# Altium project 0020-03_FFT2G.PrjPcb (part 4 of 5)

## Sheet [19] Switching Regulator Module.SchDoc: Switching regulator module
size 299 x 210 mm; Address1: Gruvgatan 8; Address2: SE-42130 Västra Frölunda; Address3: http://www.omnisys.se; Address4: Phone: +46 31 734 3400; Revision: Rev; SheetNumber: 19; SheetTotal: 21; CompanyName: Omnisys Instruments AB; Project: Enter value; ReleaseDate: Date; PageSetup: Record=PageOptions|CenterHorizontal=True|CenterVertical=True|PrintScale=0.97|XCorrection=1.00|YCorrection=1.00|PrintKind=0|BorderSize=5000000|LeftOffset=0|BottomOffset=0|Orientation=2|PaperLength=1000|PaperWidth=1000|Scale=100|PaperSource=7|PrintQuality=-4|MediaType=1|DitherType=10|PaperKind=A3|PrintScaleMode=1; Notes: No notes; Part_And_Rev: 0000-00; Drawing_Configuration: No Configuration; Adr1: August Barks gata 6B; Adr2: SE-421 32 Västra Frölunda; Adr3: Sweden; Webpage: www.omnisys.se
Used 4 times, as channels POWER/Ch_A 1.0V, POWER/Ch_B 2.5V, POWER/Ch_C 2.3V, POWER/Ch_D 3.8V. Parts and nets are listed once, with the designators drawn on the sheet.
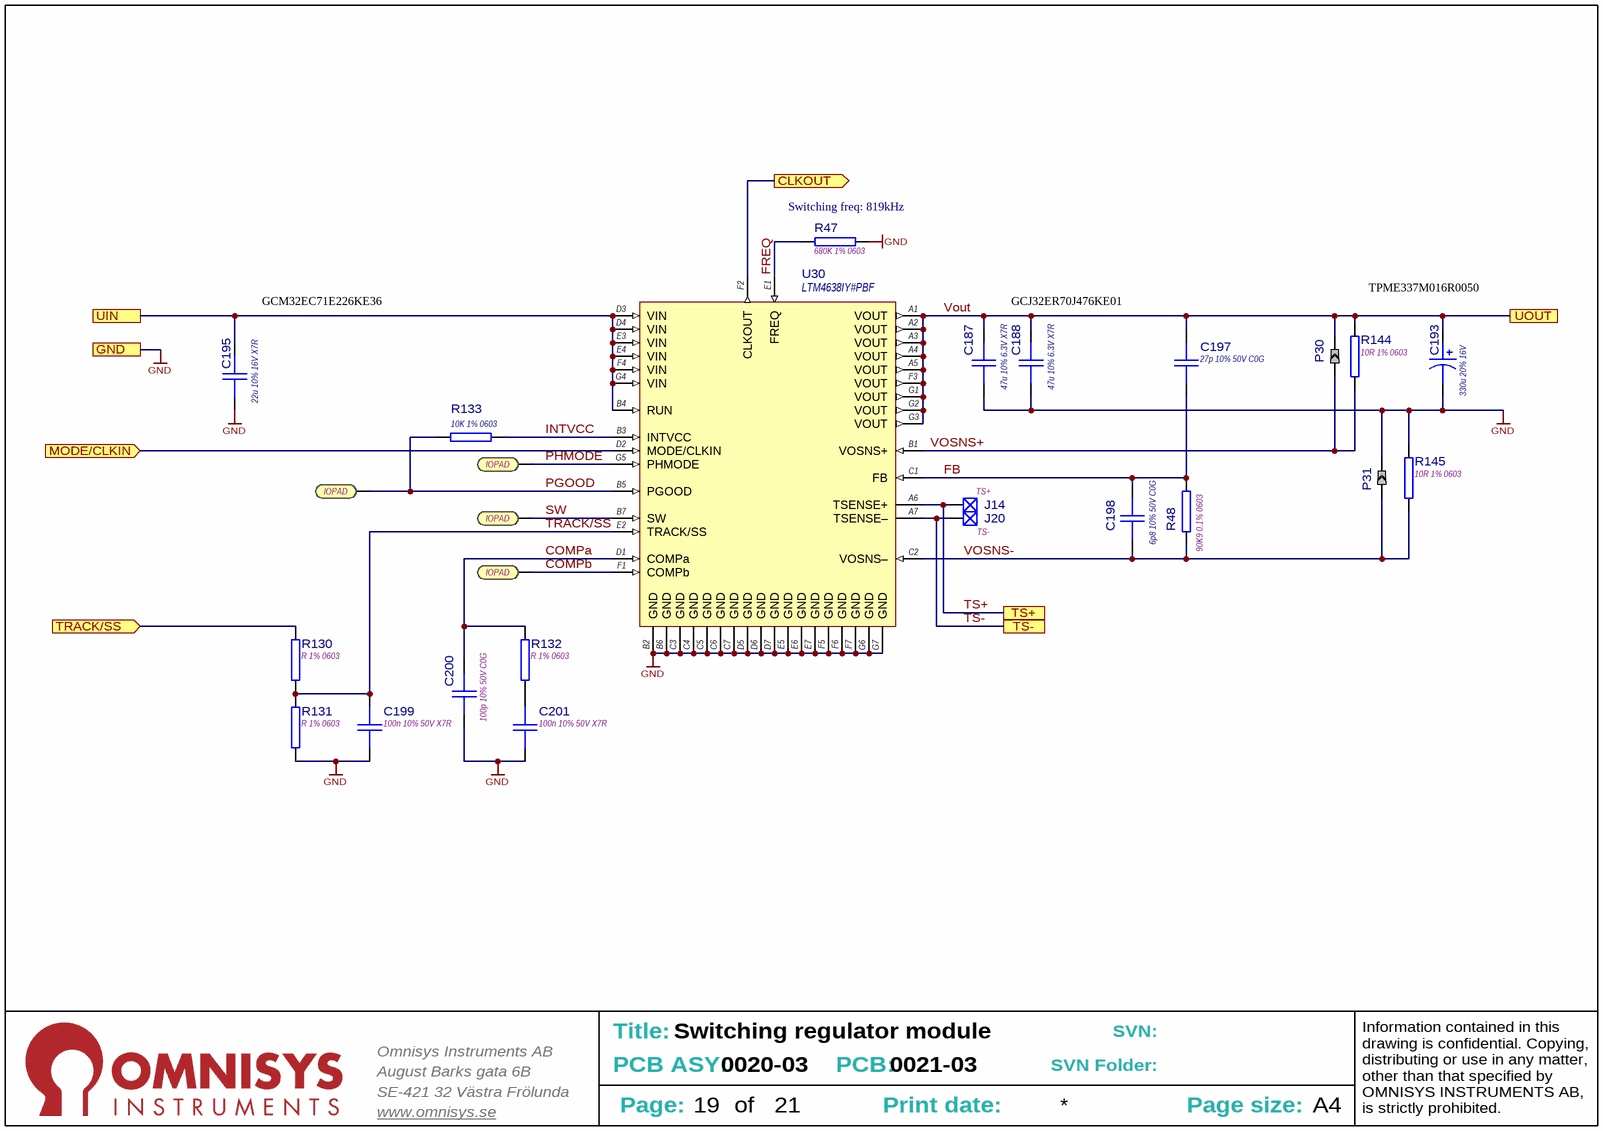
[diagram p11: [19] Switching Regulator Module.SchDoc]

### Parts
C187  47u 10% 6.3V X7R  [CAPC3225X270N]
C188  47u 10% 6.3V X7R  [CAPC3225X270N]
C193  330u 20% 16V  [CAPMP7343X43N]
C195  22u 10% 16V X7R  [CAPC3225X270N]
C197  27p 10% 50V C0G  [CAPC1608X90N]
C198  6p8 10% 50V C0G  [CAPC1608X90N]
C199  100n 10% 50V X7R  [CAPC1608X90N]
C200  100p 10% 50V C0G  [CAPC1608X90N]
C201  100n 10% 50V X7R  [CAPC1608X90N]
J12  IOPAD  [SMT_IO_PAD_2x1MM]  (no BOM)
J13  IOPAD  [SMT_IO_PAD_2x1MM]  (no BOM)
J14  TS+  [TP-SMD_1MM]
J16  IOPAD  [SMT_IO_PAD_2x1MM]  (no BOM)
J20  TS-  [TP-SMD_1MM]
J21  IOPAD  [SMT_IO_PAD_2x1MM]  (no BOM)
P30  Solder Jumper  [SolderJumper-Footprint-1]  (value not drawn)  (no BOM)
P31  Solder Jumper  [SolderJumper-Footprint-1]  (value not drawn)  (no BOM)
R47  680K 1% 0603  [RESC1608N]
R48  90K9 0.1% 0603  [RESC1608L]
R130  R 1% 0603  [RESC1608N]
R131  R 1% 0603  [RESC1608N]
R132  R 1% 0603  [RESC1608N]
R133  10K 1% 0603  [RESC1608L]
R144  10R 1% 0603  [RESC1608N]
R145  10R 1% 0603  [RESC1608N]
U30  LTM4638IY#PBF  [BGA49C80P7X7_625X625X536]

### Ports
CLKOUT (out), GND, MODE/CLKIN (in), TRACK/SS (in), TS+, TS-, UIN, UOUT

### Nets
GND: C187.2 C188.2 C193.2 C195.2 C199.2 C200.2 C201.2 P31.2 R47.1 R131.1 R145.2 U30.B2(GND) U30.B6(GND) U30.C3(GND) U30.C4(GND) U30.C5(GND) U30.C6(GND) U30.C7(GND) U30.D5(GND) U30.D6(GND) U30.D7(GND) U30.E5(GND) U30.E6(GND) U30.E7(GND) U30.F5(GND) U30.F6(GND) U30.F7(GND) U30.G6(GND) U30.G7(GND) ; port GND
CLKOUT: U30.F2(CLKOUT) ; port CLKOUT
COMPa: C200.1 R132.2 U30.D1(COMPa)
COMPb: J21.1 U30.F1(COMPb)
FB: C197.2 C198.1 R48.2 U30.C1(FB)
FREQ: R47.2 U30.E1(FREQ)
INTVCC: R133.2 U30.B3(INTVCC)
MODE/CLKIN: U30.D2(MODE/CLKIN) ; port MODE/CLKIN
PGOOD: J12.1 R133.1 U30.B5(PGOOD)
PHMODE: J13.1 U30.G5(PHMODE)
SW: J16.1 U30.B7(SW)
TRACK/SS: C199.1 R130.1 R131.2 U30.E2(TRACK/SS)
TRACK/SS: R130.2 ; port TRACK/SS  [a separate net that carries the same name]
TS+: J14.1 U30.A6(TSENSE+) ; port TS+
TS-: J20.1 U30.A7(TSENSE–) ; port TS-
UIN: C195.1 U30.B4(RUN) U30.D3(VIN) U30.D4(VIN) U30.E3(VIN) U30.E4(VIN) U30.F4(VIN) U30.G4(VIN) ; port UIN
VOSNS+: P30.1 R144.1 U30.B1(VOSNS+)
VOSNS-: C198.2 P31.1 R48.1 R145.1 U30.C2(VOSNS–)
Vout: C187.1 C188.1 C193.1 C197.1 P30.2 R144.2 U30.A1(VOUT) U30.A2(VOUT) U30.A3(VOUT) U30.A4(VOUT) U30.A5(VOUT) U30.F3(VOUT) U30.G1(VOUT) U30.G2(VOUT) U30.G3(VOUT) ; port UOUT
NetC201_1: C201.1 R132.1

### Channels
POWER/Ch_A 1.0V: designators end in .1; ports CLKOUT=CLK1 GND=GND MODE/CLKIN=NetP25_2 TRACK/SS=NetR130.1_2 TS+=TEMP_PWR TS-=GND UIN=UIN_F UOUT=+1V0
POWER/Ch_B 2.5V: designators end in .2; ports CLKOUT=CLK2 GND=GND MODE/CLKIN=NetP22_2 TRACK/SS=+1V0 TS+=TS+_Ch_B 2.5V TS-=TS-_Ch_B 2.5V UIN=UIN_F UOUT=+2V5
POWER/Ch_C 2.3V: designators end in .3; ports CLKOUT=CLK3 GND=GND MODE/CLKIN=NetP23_2 TRACK/SS=+2V5 TS+=TS+_Ch_C 2.3V TS-=TS-_Ch_C 2.3V UIN=UIN_F UOUT=+2V3
POWER/Ch_D 3.8V: designators end in .4; ports CLKOUT=NetU30.4_F2 GND=GND MODE/CLKIN=NetP24_2 TRACK/SS=+2V3 TS+=TS+_Ch_D 3.8V TS-=TS-_Ch_D 3.8V UIN=UIN_F UOUT=+3.8V

### Notes on the sheet
- (near R47) Switching freq: 819kHz
- GCM32EC71E226KE36
- GCJ32ER70J476KE01
- TPME337M016R0050
- August Barks gata 6B
- Omnisys Instruments AB
- Title:
- PCB ASY:
- PCB:
- SVN:
- SVN Folder:
- SE-421 32 Västra Frölunda
- www.omnisys.se
- Page:
- of
- Print date:
- Page size:
- A4
- Information contained in this drawing is confidential. Copying, distributing or use in any matter, other than that specified by OMNISYS INSTRUMENTS AB, is strictly prohibited.

### Library data of the parts
C187 C188 = CMP-0300-002062-5: Ceramic Chip Capacitor, 1210/3225; Capacitance: 47µF; Temperature Charateristics: X7R; Tolerance: 10%; Thickness: 2.7mm; Case/Package: 1210/3225; Rated Voltage: 6.3V
C193 = CMP-0300-000208-8: as C53 on sheet [16] POWER; Rated Voltage: 16V; Tolerance: 20%; Case/Package: 7343
C195 = CMP-0300-003327-5: Ceramic Chip Capacitor, 1210/3225; Capacitance: 22µF; Tolerance: 10%; Temperature Charateristics: X7R; Thickness: 2.7mm; Case/Package: 1210/3225; Rated Voltage: 16V
C197 = CMP-0300-002442-6: Ceramic Chip Capacitor, 0603/1608; Tolerance: 5%; Capacitance: 27pF; Package: 1608/0603; Temperature Charateristics: C0G; Rated Voltage: 50V; Thickness: 900µm; Weight: 9mg
C198 = CMP-0300-002430-5: Ceramic Chip Capacitor, 0603/1608; Tolerance: 0%; Capacitance: 6.8pF; Package: 1608/0603; Temperature Charateristics: C0G; Rated Voltage: 50V; Thickness: 900µm; Weight: 9mg
C199 C201 = CMP-0300-002665-6: as C161-C168 on sheet [11] FPGA_CONFIG; Package: 1608/0603; Temperature Charateristics: X7R; Tolerance: 10%; Rated Voltage: 50V; Thickness: 900µm; Weight: 9mg
C200 = CMP-0300-002450-6: Ceramic Chip Capacitor, 0603/1608; Tolerance: 5%; Capacitance: 100pF; Package: 1608/0603; Temperature Charateristics: C0G; Rated Voltage: 50V; Thickness: 900µm; Weight: 9mg
J12 J13 J16 J21 = CMP-1000-000152-5: IO pad used for test points and flying leads.
J14 J20 = CMP-3600-000000-1: TP SMD 1mm
P30 P31 = CMP-1600-000025-5: Solder jumper, clearance 0.125mm
R47 = CMP-1800-002089-5: Thick film Chip Resistor, 0603/1608; Power: 100mW; Maximum working voltage: 75V; Temp. Coefficent: 0.01%; Tolerance: 1%; Value: 680k; Case/Package: 0603/1608; Composition: Thick film
R48 = CMP-1800-002529-4: Thin film Chip Resistor, 0603/1608; Value: 90.9k; Maximum working voltage: 50V; Power: 100mW; Temp. Coefficent: 0.0015%; Tolerance: 0.1%; Case/Package: 0603/1608; Composition: Thin film
R130-R132 = CMP-1800-003157-4: Thick film Chip Resistor, 0603/1608; Power: 100mW; Maximum working voltage: 75V; Temp. Coefficent: 0.01%; Value: 1G; Tolerance: 1%; Case/Package: 0603/1608; Composition: Thick film
R133 = CMP-1800-002045-5: as R65#1 on sheet [16] POWER; Value: 10k; Tolerance: 1%; Case/Package: 0603/1608; Composition: Thick film
R144 R145 = CMP-1800-001974-5: Thick film Chip Resistor, 0603/1608; Value: 10; Power: 100mW; Maximum working voltage: 75V; Temp. Coefficent: 0.01%; Tolerance: 1%; Case/Package: 0603/1608; Composition: Thick film
U30 = CMP-2100-000582-3: 20Vin, 15A Step-Down DC/DC uModule Regulator

## Sheet [17] POWER-FILTER_LDO.SchDoc: Power LDO
size 393 x 281 mm; SheetNumber: 17; SheetTotal: 21; PageSetup: Record=PageOptions|CenterHorizontal=True|CenterVertical=True|PrintScale=0.94|XCorrection=0.00|YCorrection=0.00|PrintKind=0|BorderSize=5000000|LeftOffset=0|BottomOffset=0|Orientation=2|PaperLength=1000|PaperWidth=1000|Scale=100|PaperSource=15|PrintQuality=600|MediaType=1|DitherType=10|PrintScaleMode=1|PaperKind=A4; Adr1: August Barks gata 6B; Adr2: SE-421 32 Västra Frölunda; Adr3: Sweden; Webpage: www.omnisys.se
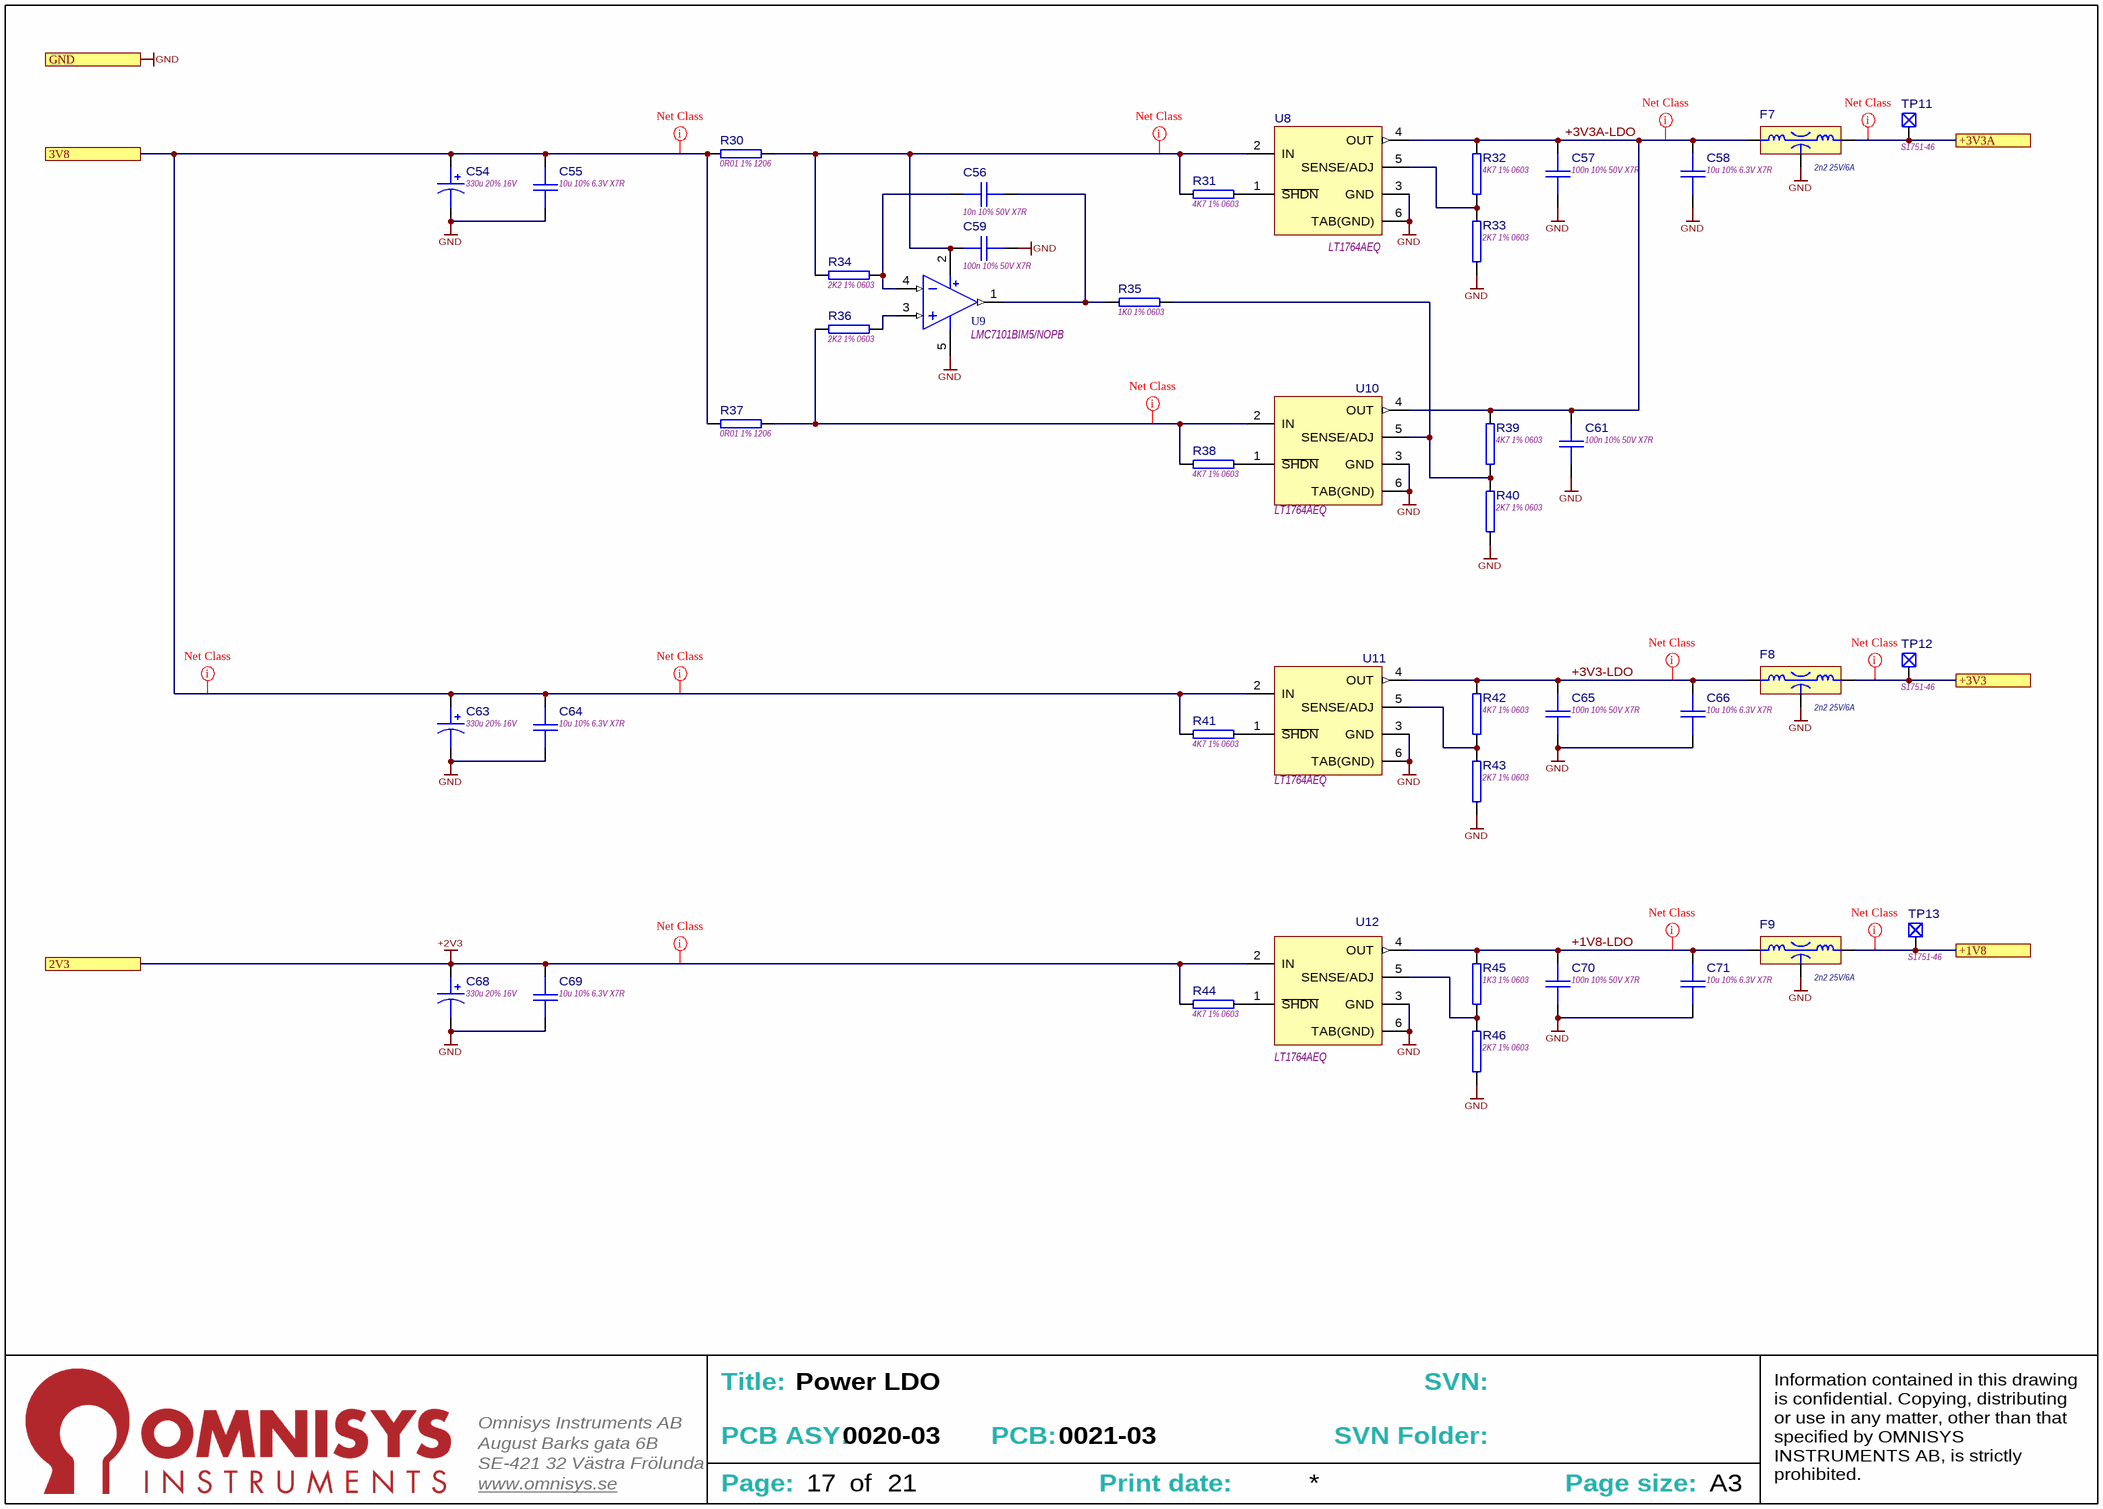
[diagram p12: [17] POWER-FILTER_LDO.SchDoc]

### Parts
C54  330u 20% 16V  [CAPMP7343X43N]
C55  10u 10% 6.3V X7R  [CAPC2012X145N]
C56  10n 10% 50V X7R  [CAPC1608X90N]
C57  100n 10% 50V X7R  [CAPC1608X90N]
C58  10u 10% 6.3V X7R  [CAPC2012X145N]
C59  100n 10% 50V X7R  [CAPC1608X90N]
C61  100n 10% 50V X7R  [CAPC1608X90N]
C63  330u 20% 16V  [CAPMP7343X43N]
C64  10u 10% 6.3V X7R  [CAPC2012X145N]
C65  100n 10% 50V X7R  [CAPC1608X90N]
C66  10u 10% 6.3V X7R  [CAPC2012X145N]
C68  330u 20% 16V  [CAPMP7343X43N]
C69  10u 10% 6.3V X7R  [CAPC2012X145N]
C70  100n 10% 50V X7R  [CAPC1608X90N]
C71  10u 10% 6.3V X7R  [CAPC2012X145N]
F7  2n2 25V/6A  [FIL_NFE31P]
F8  2n2 25V/6A  [FIL_NFE31P]
F9  2n2 25V/6A  [FIL_NFE31P]
R30  0R01 1% 1206  [RESC3216N]
R31  4K7 1% 0603  [RESC1608N]
R32  4K7 1% 0603  [RESC1608N]
R33  2K7 1% 0603  [RESC1608N]
R34  2K2 1% 0603  [RESC1608N]
R35  1K0 1% 0603  [RESC1608N]
R36  2K2 1% 0603  [RESC1608N]
R37  0R01 1% 1206  [RESC3216N]
R38  4K7 1% 0603  [RESC1608N]
R39  4K7 1% 0603  [RESC1608N]
R40  2K7 1% 0603  [RESC1608N]
R41  4K7 1% 0603  [RESC1608N]
R42  4K7 1% 0603  [RESC1608N]
R43  2K7 1% 0603  [RESC1608N]
R44  4K7 1% 0603  [RESC1608N]
R45  1K3 1% 0603  [RESC1608N]
R46  2K7 1% 0603  [RESC1608N]
TP11  S1751-46  [S1751-46]
TP12  S1751-46  [S1751-46]
TP13  S1751-46  [S1751-46]
U8  LT1764AEQ  [TO170P1394X457-6N]
U9  LMC7101BIM5/NOPB  [SOT95P280X100-5N]
U10  LT1764AEQ  [TO170P1394X457-6N]
U11  LT1764AEQ  [TO170P1394X457-6N]
U12  LT1764AEQ  [TO170P1394X457-6N]

### Ports
2V3, 3V8, +1V8, +3V3, +3V3A, GND

### Nets
+1V8: F9.2(Out) TP13.1 ; port +1V8
+2V3: C68.1 C69.1 R44.1 U12.2(IN) ; port 2V3
+3V3: F8.2(Out) TP12.1 ; port +3V3
+3V3A: F7.2(Out) TP11.1 ; port +3V3A
GND: C54.2 C55.2 C57.2 C58.2 C59.2 C61.2 C63.2 C64.2 C65.1 C66.2 C68.2 C69.2 C70.1 C71.2 F7.3(Gnd) F8.3(Gnd) F9.3(Gnd) R33.2 R40.2 R43.2 R46.2 U8.3(GND) U8.6(TAB(GND)) U9.5(V-) U10.3(GND) U10.6(TAB(GND)) U11.3(GND) U11.6(TAB(GND)) U12.3(GND) U12.6(TAB(GND)) ; port GND
+1V8-LDO: C70.2 C71.1 F9.1(In) R45.1 U12.4(OUT)
+3.8V: C54.1 C55.1 C63.1 C64.1 R30.1 R37.1 R41.1 U11.2(IN) ; port 3V8
+3V3-LDO: C65.2 C66.1 F8.1(In) R42.1 U11.4(OUT)
+3V3A-LDO: C57.1 C58.1 C61.1 F7.1(In) R32.1 R39.1 U8.4(OUT) U10.4(OUT)
NetC56_1: C56.1 R34.2 U9.4(IN-)
NetC56_2: C56.2 R35.1 U9.1(OUT)
NetC59_1: C59.1 R30.2 R31.1 R34.1 U8.2(IN) U9.2(V+)
NetR31_2: R31.2 U8.1(~{SHDN})
NetR32_2: R32.2 R33.1 U8.5(SENSE/ADJ)
NetR35_2: R35.2 R39.2 R40.1 U10.5(SENSE/ADJ)
NetR36_1: R36.1 R37.2 R38.1 U10.2(IN)
NetR36_2: R36.2 U9.3(IN+)
NetR38_2: R38.2 U10.1(~{SHDN})
NetR41_2: R41.2 U11.1(~{SHDN})
NetR42_2: R42.2 R43.1 U11.5(SENSE/ADJ)
NetR44_2: R44.2 U12.1(~{SHDN})
NetR45_2: R45.2 R46.1 U12.5(SENSE/ADJ)

### Layout directives
net class Power: +1V8, +1V8-LDO, +2V3, +3.8V, +3V3, +3V3-LDO, +3V3A, +3V3A-LDO, NetC59_1, NetR36_1

### Notes on the sheet
- Title:
- SVN:
- August Barks gata 6B
- SE-421 32 Västra Frölunda
- Omnisys Instruments AB
- PCB ASY:
- PCB:
- SVN Folder:
- www.omnisys.se
- Page:
- of
- Print date:
- Page size:
- A3
- Information contained in this drawing is confidential. Copying, distributing or use in any matter, other than that specified by OMNISYS INSTRUMENTS AB, is strictly prohibited.

### Library data of the parts
C54 C63 C68 = CMP-0300-000208-8: Standard tantalum capacitor, 7343/Case E; DCL: 52.8A; DF: 30%; ESR: 0.4; Capacitance: 330µF; Tolerance: 20%; Rated Voltage: 16V; Case/Package: 7343
C55 C58 C64 C66 C69 C71 = CMP-0300-002090-7: Ceramic Chip Capacitor, 0805/2012; Capacitance: 10µF; Package: 2012/0805; Temperature Charateristics: X7R; Tolerance: 10%; Rated Voltage: 6.3V; Thickness: 1.4mm
C56 = CMP-0300-002475-6: as C81 on sheet [7] ETH; Package: 1608/0603; Rated Voltage: 50V; Thickness: 900µm; Weight: 9mg
C57 C59 C61 C65 C70 = CMP-0300-002665-6: as C161-C168 on sheet [11] FPGA_CONFIG; Package: 1608/0603; Temperature Charateristics: X7R; Tolerance: 10%; Rated Voltage: 50V; Thickness: 900µm; Weight: 9mg
F7-F9 = CMP-0600-000138-4: 2n2 +50%-50%  25V/6A NFE31PT222Z1E9 LC Combined Filter Feed through Type; Max Current: 6A; Max Voltage: 25V; Tolerance: +50%-50%; PartNumber: NFE31PT222Z1E9
R30 R37 = CMP-1800-002821-3: Thick film Chip Resistor, 1206/3216; Value: 10m; Temp. Coefficent: 0.01%; Maximum working voltage: 200V; Power: 250mW; Tolerance: 1%; Case/Package: 1206/3216; Composition: Thick film
R31 R32 R38 R39 R41 R42 R44 = CMP-1800-002037-5: as R100 on sheet [11] FPGA_CONFIG; Tolerance: 1%; Case/Package: 0603/1608; Composition: Thick film
R33 R40 R43 R46 = CMP-1800-002031-5: Thick film Chip Resistor, 0603/1608; Value: 2.7k; Power: 100mW; Maximum working voltage: 75V; Temp. Coefficent: 0.01%; Tolerance: 1%; Case/Package: 0603/1608; Composition: Thick film
R34 R36 = CMP-1800-002029-5: Thick film Chip Resistor, 0603/1608; Value: 2.2k; Power: 100mW; Maximum working voltage: 75V; Temp. Coefficent: 0.01%; Tolerance: 1%; Case/Package: 0603/1608; Composition: Thick film
R35 = CMP-1800-002021-5: as R136 on sheet [16] POWER; Tolerance: 1%; Case/Package: 0603/1608; Composition: Thick film
R45 = CMP-1800-002024-5: Thick film Chip Resistor, 0603/1608; Value: 1.3k; Power: 100mW; Maximum working voltage: 75V; Temp. Coefficent: 0.01%; Tolerance: 1%; Case/Package: 0603/1608; Composition: Thick film
TP11-TP13 = CMP-3600-000004-2: SMD Test point clip; PartNumber: S1751-46
U8 U10-U12 = CMP-2100-000275-3: 3A, Fast Transient Respons, Low noise LOD regulator; Output Voltage: 1.21V to 20V; Input Voltage max: 20V; Vdo: 340mV; Case: D2-PAK-5; Output current: 3A
U9 = CMP-2100-000592-1: IC, OP AMP, SINGLE, 1MHZ, SMD; Voltage Gain: 110.63dB; Number of Channels: 1; Input Offset Voltage (Vos): 110uV; Input Bias Current: 1pA; Max Supply Voltage: 15.5V; Power Supply Rejection Ratio (PSRR): 65dB; Max Supply Current: 850uA; Operating Supply Current: 800uA; Output Current: 50mA; Min Supply Voltage: 2.7V; Common Mode Rejection Ratio: 60dB; Slew Rate: 1.1V/µs; Gain Bandwidth Product: 1.1MHz; Unity Gain Bandwidth Product: 1MHz; Width: 1.6mm; Number of Pins: 5; Bandwidth: 1MHz; Package Quantity: 1000; Case/Package: SOT-23; Number of Circuits: 1; Number of Amplifiers: 1; Min Operating Temperature: -40°C; Number of Elements: 1; Height: 1.02mm; Output Current per Channel: 50mA; Max Operating Temperature: 85°C; Mount: Surface Mount; Lead Free: Lead Free; Length: 2.92mm; Radiation Hardening: No; REACH SVHC: No SVHC; Packaging: Tape and Reel; Nominal Supply Current: 800uA